# EAGLE design Adafruit Metro RP2040 (EAGLE 9.6.2)
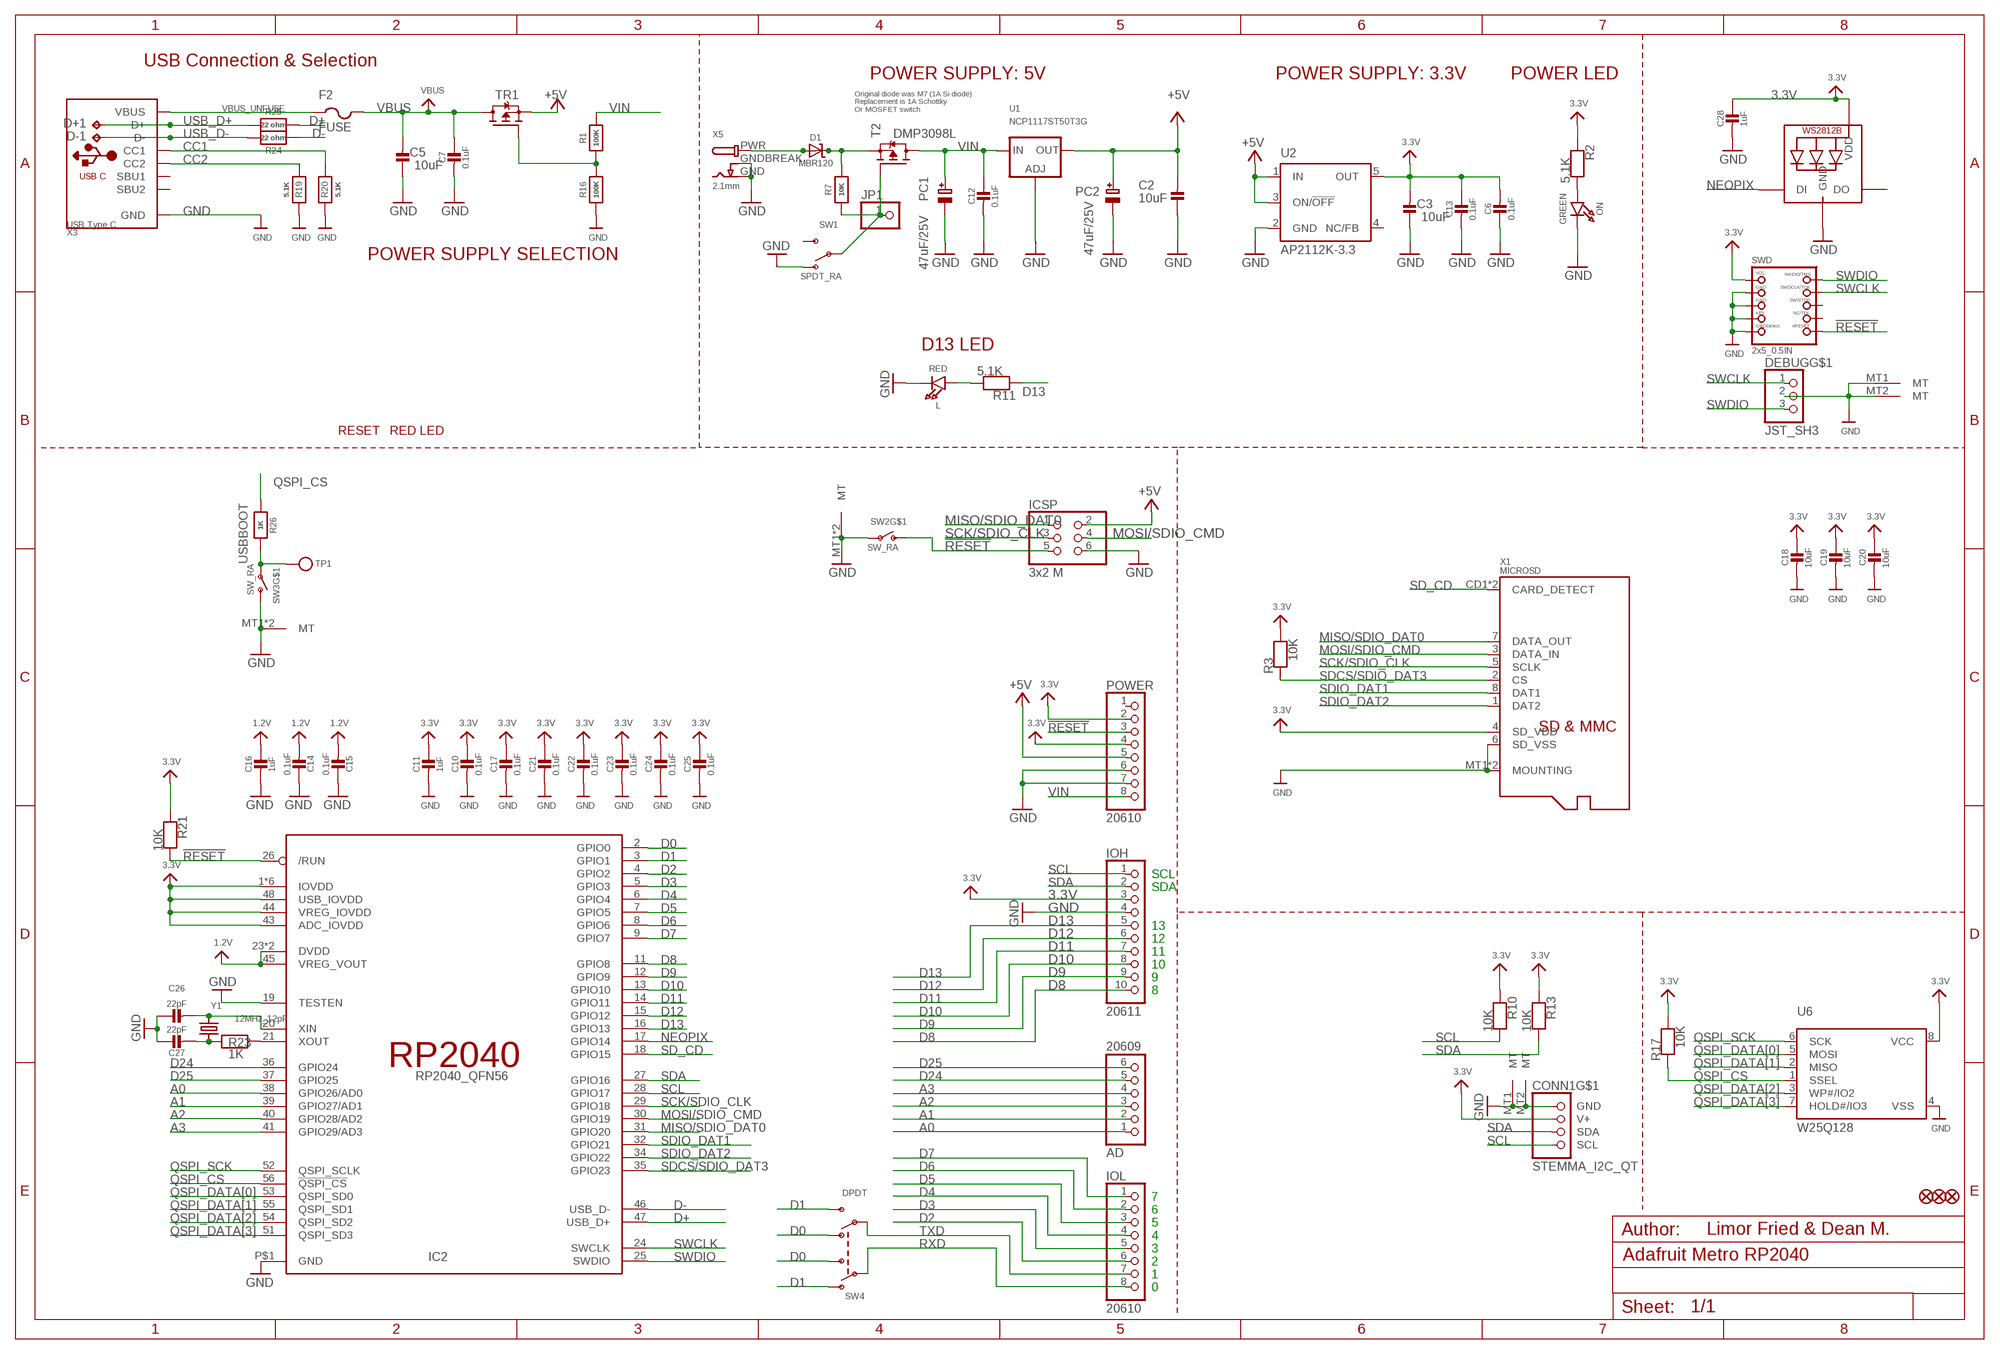
[diagram p0: schematic, sheet 1]

## Parts
AD  20609  HEADER-1X6OVALWAVE  [1X06_OVALWAVE]
C2  10uF  CAP_CERAMIC0805-NOOUTLINE  [0805-NO]
C3  10uF  CAP_CERAMIC0805-NOOUTLINE  [0805-NO]
C5  10uF  CAP_CERAMIC0805-NOOUTLINE  [0805-NO]
C6  0.1uF  CAP_CERAMIC0603_NO  [0603-NO]
C7  0.1uF  CAP_CERAMIC0603_NO  [0603-NO]
C10  0.1uF  CAP_CERAMIC0603_NO  [0603-NO]
C11  1uF  CAP_CERAMIC0603_NO  [0603-NO]
C12  0.1uF  CAP_CERAMIC0603_NO  [0603-NO]
C13  0.1uF  CAP_CERAMIC0603_NO  [0603-NO]
C14  0.1uF  CAP_CERAMIC0603_NO  [0603-NO]
C15  0.1uF  CAP_CERAMIC0603_NO  [0603-NO]
C16  1uF  CAP_CERAMIC0603_NO  [0603-NO]
C17  0.1uF  CAP_CERAMIC0603_NO  [0603-NO]
C18  10uF  CAP_CERAMIC0805-NOOUTLINE  [0805-NO]
C19  10uF  CAP_CERAMIC0805-NOOUTLINE  [0805-NO]
C20  10uF  CAP_CERAMIC0805-NOOUTLINE  [0805-NO]
C21  0.1uF  CAP_CERAMIC0603_NO  [0603-NO]
C22  0.1uF  CAP_CERAMIC0603_NO  [0603-NO]
C23  0.1uF  CAP_CERAMIC0603_NO  [0603-NO]
C24  0.1uF  CAP_CERAMIC0603_NO  [0603-NO]
C25  0.1uF  CAP_CERAMIC0603_NO  [0603-NO]
C26  22pF  CAP_CERAMIC0603_NO  [0603-NO]
C27  22pF  CAP_CERAMIC0603_NO  [0603-NO]
C28  1uF  CAP_CERAMIC0603_NO  [0603-NO]
CONN1  STEMMA_I2C_QT  [JST_SH4]
D1  MBR120  DIODE-SCHOTTKYSOD-123  [SOD-123]
D+1  TPB1,27  [B1,27]
D-1  TPB1,27  [B1,27]
DEBUG  JST_SH3  CON_JST_SH_3PINSH  [JST_SH3]
F2  FUSE  PTCFUSE-1206  [R1206]
FD1  FIDUCIAL_1MM  [FIDUCIAL_1MM]
FD2  FIDUCIAL_1MM  [FIDUCIAL_1MM]
FD3  FIDUCIAL_1MM  [FIDUCIAL_1MM]
IC2  RP2040_QFN56  [QFN56_7MM_REDUCEDEPAD]
ICSP  3x2 M  HEADER-2X3  [2X03_ROUND_70MIL]
IOH  20611  HEADER-1X10OVALWAVE  [1X10_OVALWAVE]
IOL  20610  HEADER-1X8OVALWAVE  [1X08_OVALWAVE]
JP1  HEADER-1X1ROUND  [1X01_ROUND]
L  RED  LED0603_NOOUTLINE  [CHIPLED_0603_NOOUTLINE]
LED2  WS2812B_3535FULL  [LED3535_FULLPADS]
ON  GREEN  LED0603_NOOUTLINE  [CHIPLED_0603_NOOUTLINE]
PC1  47uF/25V  CAP_ELECTROLYTICPANASONIC_D  [PANASONIC_D]
PC2  47uF/25V  CAP_ELECTROLYTICPANASONIC_D  [PANASONIC_D]
POWER  20610  HEADER-1X8OVALWAVE  [1X08_OVALWAVE]
R1  100K  RESISTOR_0603_NOOUT  [0603-NO]
R2  5.1K  RESISTOR_0603_NOOUT  [0603-NO]
R3  10K  RESISTOR_0603_NOOUT  [0603-NO]
R7  10K  RESISTOR_0603_NOOUT  [0603-NO]
R10  10K  RESISTOR_0603_NOOUT  [0603-NO]
R11  5.1K  RESISTOR_0603_NOOUT  [0603-NO]
R13  10K  RESISTOR_0603_NOOUT  [0603-NO]
R16  100K  RESISTOR_0603_NOOUT  [0603-NO]
R17  10K  RESISTOR_0603_NOOUT  [0603-NO]
R19  5.1K  RESISTOR_0603_NOOUT  [0603-NO]
R20  5.1K  RESISTOR_0603_NOOUT  [0603-NO]
R21  10K  RESISTOR_0603_NOOUT  [0603-NO]
R23  1K  RESISTOR_0603_NOOUT  [0603-NO]
R24  22 ohm  RESISTOR_0603_NOOUT  [0603-NO]
R25  22 ohm  RESISTOR_0603_NOOUT  [0603-NO]
R26  1K  RESISTOR_0603_NOOUT  [0603-NO]
SW1  SPDT_RA  SWITCH_SPDT  [SPDT_SMT_SSSS811101]
SW2  SW_RA  SWITCH_SPST_MNT_TACT_RA  [SPST_TACTILE_RA]
SW3  SW_RA  SWITCH_SPST_MNT_TACT_RA  [SPST_TACTILE_RA]
SW4  DPDT  SWITCH_DPDTEG1390  [EG1390]
SWD  2x5_0.5IN  JTAG-CORTEXBOXPOSTS  [2X05_1.27MM_BOX_POSTS]
T2  DMP3098L  MOSFET-PWIDE  [SOT23-WIDE]
TP1  TESTPOINTROUND1.5MMNO  [TESTPOINT_ROUND_1.5MM_NO]
TR1  DMP3098L  MOSFET-PWIDE  [SOT23-WIDE]
U1  NCP1117ST50T3G  LM1117SOT223-REFLOW  [SOT223-R]
U2  AP2112K-3.3  LP2985-XXDBVR33  [SOT23-DBV]
U6  W25Q128  SPIFLASH_8PIN208MIL  [SOIC8_208MIL]
X1  MICROSD  [MICROSD]
X3  USB Type C  USB_C  [USB_C_CUSB31-CFM2AX-01-X]
X5  2.1mm  DCBARRELPTH  [DCJACK_2MM_PTH]
Y1  12MHz_12pF  CRYSTAL2.5X2.0  [CRYSTAL_2.5X2]

## Nets
1.2V: C14.2 C15.2 C16.1 IC2.23(DVDD) IC2.45(VREG_VOUT) IC2.50(DVDD)
3.3V: C3.2 C6.2 C10.1 C11.1 C13.1 C17.1 C18.1 C19.1 C20.1 C21.1 C22.1 C23.1 C24.1 C25.1 C28.1 CONN1.2(V+) IC2.1(IOVDD) IC2.10(IOVDD) IC2.22(IOVDD) IC2.33(IOVDD) IC2.42(IOVDD) IC2.43(ADC_IOVDD) IC2.44(VREG_IOVDD) IC2.48(USB_IOVDD) IC2.49(IOVDD) IOH.3 LED2.2(VDD) POWER.2 POWER.4 R2.1 R3.2 R10.1 R13.1 R17.2 R21.1 SWD.1(VCC) U2.5(OUT) U6.8(VCC) X1.4(SD_VDD)
!RESET: IC2.26(/RUN) ICSP.5 POWER.3 R21.2 SW2.2(S) SWD.10(NRESET)
+5V [HIGHPOWER]: C2.2 ICSP.2 PC2.+ POWER.5 TR1.2(S) U1.2(OUT) U1.4(OUT) U2.1(IN) U2.3(ON/!OFF)
A0: AD.1 IC2.38(GPIO26/AD0)
A1: AD.2 IC2.39(GPIO27/AD1)
A2: AD.3 IC2.40(GPIO28/AD2)
A3: AD.4 IC2.41(GPIO29/AD3)
CC1: R20.2 X3.A5(CC1)
CC2: R19.2 X3.B5(CC2)
D0: IC2.2(GPIO0) SW4.O2 SW4.S1
D1: IC2.3(GPIO1) SW4.O1 SW4.S2
D2: IC2.4(GPIO2) IOL.6
D3: IC2.5(GPIO3) IOL.5
D4: IC2.6(GPIO4) IOL.4
D5: IC2.7(GPIO5) IOL.3
D6: IC2.8(GPIO6) IOL.2
D7: IC2.9(GPIO7) IOL.1
D8: IC2.11(GPIO8) IOH.10
D9: IC2.12(GPIO9) IOH.9
D10: IC2.13(GPIO10) IOH.8
D11: IC2.14(GPIO11) IOH.7
D12: IC2.15(GPIO12) IOH.6
D13: IC2.16(GPIO13) IOH.5 R11.1
D24: AD.5 IC2.36(GPIO24)
D25: AD.6 IC2.37(GPIO25)
D+: IC2.47(USB_D+) R25.2
D-: IC2.46(USB_D-) R24.2
GND: C2.1 C3.1 C5.1 C6.1 C7.2 C10.2 C11.2 C12.2 C13.2 C14.1 C15.1 C16.2 C17.2 C18.2 C19.2 C20.2 C21.2 C22.2 C23.2 C24.2 C25.2 C26.1 C27.1 C28.2 CONN1.1(GND) CONN1.MT1(MT) CONN1.MT2(MT) DEBUG.2 DEBUG.MT1(MT) DEBUG.MT2(MT) IC2.19(TESTEN) IC2.P$1(GND) ICSP.6 IOH.4 L.C LED2.4(GND) ON.C PC1.- PC2.- POWER.6 POWER.7 R16.1 R19.1 R20.1 SW1.A(O) SW2.1(P) SW2.MT1(MT) SW2.MT2(MT) SW3.2(S) SW3.MT1(MT) SW3.MT2(MT) SWD.3(GND) SWD.5(GND) SWD.7(KEY) SWD.9(GNDDETECT) U1.1(ADJ) U2.2(GND) U6.4(VSS) X1.6(SD_VSS) X1.MT1(MOUNTING) X1.MT2(MOUNTING) X3.A1B12(GND) X3.B1A12(GND) X5.GND X5.GNDBREAK
MISO/SDIO_DAT0: IC2.31(GPIO20) ICSP.1 X1.7(DATA_OUT)
MOSI/SDIO_CMD: IC2.30(GPIO19) ICSP.4 X1.3(DATA_IN)
N$1: L.A R11.2
N$2: ON.A R2.2
N$9: C26.2 IC2.20(XIN) Y1.3
N$10: C27.2 R23.1 Y1.1
N$11: R1.1 R16.2 TR1.1(G)
N$12: IC2.21(XOUT) R23.2
N$15: D1.C R7.2 T2.2(S)
NEOPIX: IC2.17(GPIO14) LED2.1(DI)
PWR_SWITCH: JP1.1 R7.1 SW1.B(P) T2.1(G)
PWRIN [HIGHPOWER]: D1.A X5.PWR
QSPI_CS: IC2.56(!QSPI_CS) R17.1 R26.1 U6.1(SSEL)
QSPI_DATA[0]: IC2.53(QSPI_SD0) U6.5(MOSI)
QSPI_DATA[1]: IC2.55(QSPI_SD1) U6.2(MISO)
QSPI_DATA[2]: IC2.54(QSPI_SD2) U6.3(WP#/IO2)
QSPI_DATA[3]: IC2.51(QSPI_SD3) U6.7(HOLD#/IO3)
QSPI_SCK: IC2.52(QSPI_SCLK) U6.6(SCK)
RXD: IOL.8 SW4.P1
SCK/SDIO_CLK: IC2.29(GPIO18) ICSP.3 X1.5(SCLK)
SCL: CONN1.4(SCL) IC2.28(GPIO17) IOH.1 R10.2
SD_CD: IC2.18(GPIO15) X1.CD1(CARD_DETECT) X1.CD2(CARD_DETECT)
SDA: CONN1.3(SDA) IC2.27(GPIO16) IOH.2 R13.2
SDCS/SDIO_DAT3: IC2.35(GPIO23) R3.1 X1.2(CS)
SDIO_DAT1: IC2.32(GPIO21) X1.8(DAT1)
SDIO_DAT2: IC2.34(GPIO22) X1.1(DAT2)
SWCLK: DEBUG.1 IC2.24(SWCLK) SWD.4(SWDCLK)
SWDIO: DEBUG.3 IC2.25(SWDIO) SWD.2(SWDIO)
TXD: IOL.7 SW4.P2
USB_D+: D+1.TP R25.1 X3.A6(D+) X3.B6(D+)
USB_D-: D-1.TP R24.1 X3.A7(D-) X3.B7(D-)
USBBOOT: R26.2 SW3.1(P) TP1.P$1
VBUS [HIGHPOWER]: C5.2 C7.1 F2.2 TR1.3(D)
VBUS_UNFUSE [HIGHPOWER]: F2.1 X3.A4B9(VBUS) X3.B4A9(VBUS)
VIN [HIGHPOWER]: C12.1 PC1.+ POWER.8 R1.2 T2.3(D) U1.3(IN)
Unconnected: LED2.3(DO) POWER.1 SW1.C(S) SWD.6(SWO) SWD.8(TDI) U2.4(NC/FB) X3.A8(SBU1) X3.B8(SBU2)

## Notes on the sheet
- USB Connection & Selection
- POWER SUPPLY: 5V | POWER SUPPLY: 3.3V | POWER LED
- Original diode was M7 (1A Si diode)
  Replacement is 1A Schottky
  Or MOSFET switch
- POWER SUPPLY SELECTION
- D13 LED
- RESET | RED LED
- SCL
- SDA
- 13
- 12
- 11
- 10
- 9
- 8
- 7
- 6
- 5
- 4 | Limor Fried & Dean M.
- 3
- 2
- 1
- 0

## Library data of the parts
AD = microbuilder:HEADER-1X6: PIN HEADER
C2 C3 C5-C7 C10-C28 = microbuilder:CAP_CERAMIC: Ceramic Capacitors For new designs, use the packages preceded by an '_' character since they are more reliable: The following footprints should be used on most boards: _0402 - Standard footprint for regular board layouts _0603 - Standard footprint for regular board layouts _0805 - Standard footprint for regular board layouts _1206 - Standard footprint for regular board layouts For extremely tight-pitch boards where space is at a premium, the following 'micro-pitch' footprints can be used (smaller pads, no silkscreen outline, etc.): _0402MP - Micro-pitch footprint for very dense/compact boards _0603MP - Micro-pitch footprint for very dense/compact boards _0805MP - Micro-pitch footprint for very dense/compact boards _1206MP - Micro-pitch footprint for very dense/compact boards
CONN1 = adafruit_electromech:STEMMA_I2C; LCSC: C2845363
D1 = microbuilder:DIODE-SCHOTTKY
D+1 D-1 = testpad:TP: Test pad
DEBUG = adafruit_electromech:CON_JST_SH_3PIN
F2 = adafruit:PTCFUSE: PTC fuses, resettable thermistors
FD1-FD3 = microbuilder:FIDUCIAL: Fiducial Alignment Points Various fiducial points for machine vision alignment.; BOM: EXCLUDE
IC2 = adafruit_micro:RP2040; LCSC: C2040
ICSP = microbuilder:HEADER-2X3: PIN HEADER
IOH = microbuilder:HEADER-1X10: PIN HEADER
IOL POWER = microbuilder:HEADER-1X8: PIN HEADER
JP1 = microbuilder:HEADER-1X1: PIN HEADER
L ON = microbuilder:LED: LED 0603 - 0603 Surface Mount Package 2mA: Green LED - Low Power (3.9mcd, 2ma, 1.7Vf) - Digikey: 475-2709-2-ND Orange LED - Low Power (9.8mcd, 2ma, 1.8Vf) - Digikey: 475-1194-2-ND Red LED - Low Power (5mcd, 2ma, 1.8Vf) - Digikey: 475-1195-2-ND Yellow LED - Low Power (7mcd, 2ma, 1.8Vf) - Digikey: 475-1196-2-ND 5mA: Blue LED - Low Power (17mcd, 5ma, 2.9Vf) - Digikey: LNJ937W8CRACT-ND 0805 - 0805 Surface Mount Package 2mA: Red LED (8.8mcd, 2mA, 1.8Vf, Clear) - Low Power [Digikey: 475-2510-1-ND] Green LED (5mcd, 2mA, 1.8Vf, Clear) - Low Power [Digikey: 475-2730-1-ND] Yellow LED (11.3mcd, 2mA, 1.8Vf, Clear) - Low Power [Digikey: 475-2555-1-ND] 20mA: Red LED (104mcd, 20mA, Diffused) - LS R976 [Digikey: 475-1278-6-ND] Red LED (12mcd, 20mA, 2.0Vf, Clear) - APT2012EC [Digikey: 754-1128-1-ND] Green LED (15mcd, 20mA, 2.2Vf, Clear) - APT2012GC [Digikey: 754-1131-1-ND] Orange LED (160mcd, 20mA, 2.1Vf, Clear) - APT2012SECK [Digikey: 754-1130-1-ND] 1206 - 1206 Surface Mount Package Green LED (26mcd, 20mA, Diffused) - LG N971 [Digikey: 475-1407-6-ND] Red LED (15mcd, 20mA, Diffused) - LH N974 [Digikey: 475-1416-6-ND] Cree - Cree High-Power Surface Mount LEDs XPEBWT-L1-0000-00D50 - White 111lm 350mA 2.9Vf 6200K 110° XTEAWT-00-0000-00000LEE3 - White 114lm 350mA 2.85Vf 5000K 115° Everlight - Everlight 45-21 Series Surface Mount LEDs 45-21/QK2C-B2832AC2CB2/2T - Warm White 2000mcd 20mA 3.25Vf 3050K 120° 45-21/LK2C-B38452C4CB2/2T - Nuetral White 2000mcd 20mA 3.25Vf 4150K 120° 45-21/LK2C-B50634C6CB2/2T - Cold White 2200mcd 20mA 3.25Vf 5650K 120° PLCC2 Reverse Mount LS T77K-J1L2-1-0-2-R18-Z - Red 11.25mcd 2mA 1.8Vf 630nm 120° LO T77K-L1M2-24-Z - Orange 19.6mcd 2mA 1.8Vf 606nm 120° LY T77K-K2M1-26-Z - Yellow 15.7mcd 2mA 1.8Vf 587nm 120°; ROT: 270
LED2 = microbuilder:WS2812B
PC1 PC2 = microbuilder:CAP_ELECTROLYTIC: Electrolytic Capacitors SMT PANASONIC_C - Size C Panasonic Electrolytic Aluminum Capacitor 47µF 16V 20% Electrolytic Capacitor [Digikey: PCE3890TR-ND] PANASONIC_D - Size D Panasonic Electrolytic Aluminum Capacitor 100µF 25V 20% Electrolytic Capacitor [Digikey: PCE3898TR-ND] PTH 3.5 mm grid, 8 mm diameter ... 3.5 mm grid, 10 mm diameter ...
R1-R3 R7 R10 R11 R13 R16 R17 R19-R21 R23-R26 = microbuilder:RESISTOR: Resistors For new designs, use the packages preceded by an '_' character since they are more reliable: The following footprints should be used on most boards: _0402 - Standard footprint for regular board layouts _0603 - Standard footprint for regular board layouts _0805 - Standard footprint for regular board layouts _1206 - Standard footprint for regular board layouts For extremely tight-pitch boards where space is at a premium, the following 'micro-pitch' footprints can be used (smaller pads, no silkscreen outline, etc.): _0402MP - Micro-pitch footprint for very dense/compact boards _0603MP - Micro-pitch footprint for very dense/compact boards _0805MP - Micro-pitch footprint for very dense/compact boards _1206MP - Micro-pitch footprint for very dense/compact boards
SW1 = adafruit_electromech:SWITCH_SPDT: Switch - SPDT SSSS811101 - Horizontal Two Position SMT, 0.3A 4V [Mouser: 688-SSSS811101]
SW2 SW3 = adafruit_electromech:SWITCH_SPST_MNT: Switch - SPST 4UCon 19192 (6.7x2.6mm SMT); LCSC: C778159
SW4 = adafruit_electromech:SWITCH_DPDT: Switch - DPDT A DPDT Switch acts like an SPDT switch, but has a pair of switches instead of just one. Vertical - 0.3A @ 6V SMT - Digikey: JS202011SCQN; LCSC: C2837066
SWD = adafruit_electromech:JTAG-CORTEX: Serial Wire (SW-DP) Connector Standard 0.05" 10-pin connector is for use with the Cortex M and Cortex A SWD (serial wire debugger) interface (SW-DP) Connectors 2x05_1.27MM_SMT - Inexpensive surface-mount header with bare pins, compatible with standard 10-pin SWD cables (4UCON: 16846) 2x05_1.27MM_BOX_NOPOSTS - Polarised surface-mount box (4UCON with caps: 19735, without caps: 15117 2x05_1.27MM_BOX_POSTS - Polarised surface-mount box with mounting holes (4UCON: 20317) Pinout: http://infocenter.arm.com/help/topic/com.arm.doc.faqs/attached/13634/cortex_debug_connectors.pdf http://www.keil.com/peripherals/coresight/connectors.asp
T2 TR1 = microbuilder:MOSFET-P: P-Channel Mosfet LEGEND VDS: Voltage Drain-Source ID: Drain Current RDS(ON): Drain-Source On-State Resistance VGS(TH): Gate-Source Threshold Voltage CISS: Drain-Source Input Capacitance SOT-23 Name VDS ID RDS(ON) VGS(TH) CISS Order Number IRLML5103 30V 760mA 600 mOhm -- 75pF @ 25V Digikey: IRLML5103PBFCT-ND IRLML6401 12V 4.3A 50 mOhm 950mV @ 250µA 830pF @ 10V Digikey: IRLML6401PBFTR-ND NTR0202PL 20V 400mA 800 mOhm 2.3V @ 250uA 70pF @ 5V Digikey: NTR0202PLT1GOSTR-ND NTR4101PT1G 20V 1.8A 85 mOhm 1.2V @ 250uA 675pF @ 10V Digikey: NTR4101PT1GOSCT-ND DMP2004K 20V 600mA 900 mOhm 1V @ 250uA 175pF @ 16V Digikey: DMP2004KDICT-ND PMV65XP 20V 3.9A 76 mOhm 950mV @ 1mA 725pF @ 20V Digikey: 568-2358-2-ND TO-252 Name VDS ID RDS(ON) VGS(TH) CISS Order Number AOD417 30V 25A 34 mOhm 3V @ 250µA 920pF @ 15V Digikey: 785-1106-2-ND PowerPak Name VDS ID RDS(ON) VGS(TH) CISS Order Number AON7401 30V 12A 14 mOhm 3V @ 250µA 2600pF @ 15V Digikey: 785-1302-1-ND
TP1 = microbuilder:TESTPOINT: Test Point Various test points for characterisation and PCB testing TESTPOINT_SMT - Compact Surface Mount Test Point [Digikey: 5016KTR-ND]
U1 = microbuilder:LM1117: LM1117 Voltage Regulator LM1117 Adjustable Voltage regulator [Digikey: LM1117IMP-ADJDKR-ND] LM1117 3.3V Voltage regulator [AP1117E33GDIDKR-ND] LM1117 5.0V Voltage regulator [AP1117E50GDIDKR-ND] SOT223-REFLOW - SOT223 package for solder paste/reflow ovens SOT223-WAVE - SOT223 package for hand-soldering (larger pads) Note: For the fixed-voltage regulators, simply set the ADJ pin to GND.
U2 = SmartPrj:LP2985-XXDBVR: ULTRALOW-POWER 50-mA LOW-DROPOUT LINEAR REGULATORS 50-mA Low-Dropout Regulator Source: http://focus.ti.com/lit/ds/symlink/tps77001.pdf
U6 = microbuilder:SPIFLASH_8PIN: SOIC8 SPI Flash Be careful with the size since SOIC8 flash comes in several 'widths' SOIC8 150 mil M25P16 - 16Mbit (2Mbit x 8) Serial Flash (75MHz SPI Bus), Supply: 2.7-3.6V Digikey: SOIC8 - M25P16-VMN6P-ND SOIC8 208 mil W25Q16BVSSIG - 16Mbit (2Mbit x 8) Serial Flash (104MHz SPI Bus), Supply: 2.7-3.6V Digikey: SOIC8 - W25Q16BVSSIG-ND
X1 = adafruit_electromech:MICROSD: MicroSD/Transflash Card Holder with SPI pinout 3M: 2908-05WB-MG 4UConnector: 19656 Footprint courtesy: Adafruit Industries; JLC_ROTATION: 90; LCSC: C125617
X3 = adafruit_electromech:USB_C: USB Type-C USB 2.0 Connector; LCSC: C165948
X5 = adafruit_electromech:DCBARREL: DC Barrel Jack DCJACK_1.3MM_PTH - Through Hole 1.3mm Jack (4UConnector: 05536) DCJACK_2MM_PTH - Through Hole 2.0/2.1 Jack (4UConnector: 05537) DCJACK_2MM_SMT - SMT 2.0/2.1mm Jack(4UConnector: 03267)
Y1 = microbuilder:CRYSTAL: Crystals HC49UP - Surface Mount Crystal 4.0MHz 18pF +/-30ppm Surface Mount Crystal [Digikey: 535-9857-1-ND] 12.0 MHz Surface Mount Crystal [Digikey: 535-9869-6-ND] 25.0 MHz Surface Mount Crystal [Digikey: 535-9078-1-ND] 2.5 x 2.0mm - MEMs SMT Crystal 16.0 MHz 10pF 20ppm 2.5 x 2.0mm Crystal [Digikey -40-85°C: 535-10923-1-ND] 3.2 x 2.5mm - MEMs SMT Crystal 12.0 MHz 8pF 15ppm 3.2 x 2.5mm Crystal [Digikey: -10-70°C: 644-1047-1-ND -40-125°C: 644-1128-1-ND] 40~85°C cheaper: 644-1173-6-ND 16.0 MHz 8pF 15ppm 3.2 x 2.5mm Crystal [Digikey: -10-70°C: 644-1049-1-ND -40-125°C: 644-1129-2-ND]-40~85°C cheaper: 644-1175-6-ND 16.0 MHz 10pF 10ppm 3.2 x 2.5mm Crystal [Digikey: 644-1100-1-ND] 27.12 MHz 18pF 30ppm 3.2 x 2.5mm Crystal [Digikey: 887-1424-1-ND] 27.12MHz 10pF 10ppm 3.2 x 2.5mm Crystal [Digikey: 887-1329-1-ND] 4.9 x 1.8mm - MEMs SMT Crystal 32.768 KHz 12.5pF 20ppm 4.9 x 1.8mm Crystal [Digikey: SE2415CT-ND] 8.0 x 3.8mm - Surface Mount Crystal 32.768kHz 12.5pF 20ppm -40°C-85°C [Digikey: 535-9166-2-ND] Cylinder 32.768KHz Cylinder Crystal (2x6mm body) [Ex. Digikey: 300-8341-2-ND]

## Net classes
1 power: width 0.305 mm
3 HIGHPOWER: width 0.254 mm, drill 0.483 mm
4 LOWPOWER: width 0.254 mm

## Board
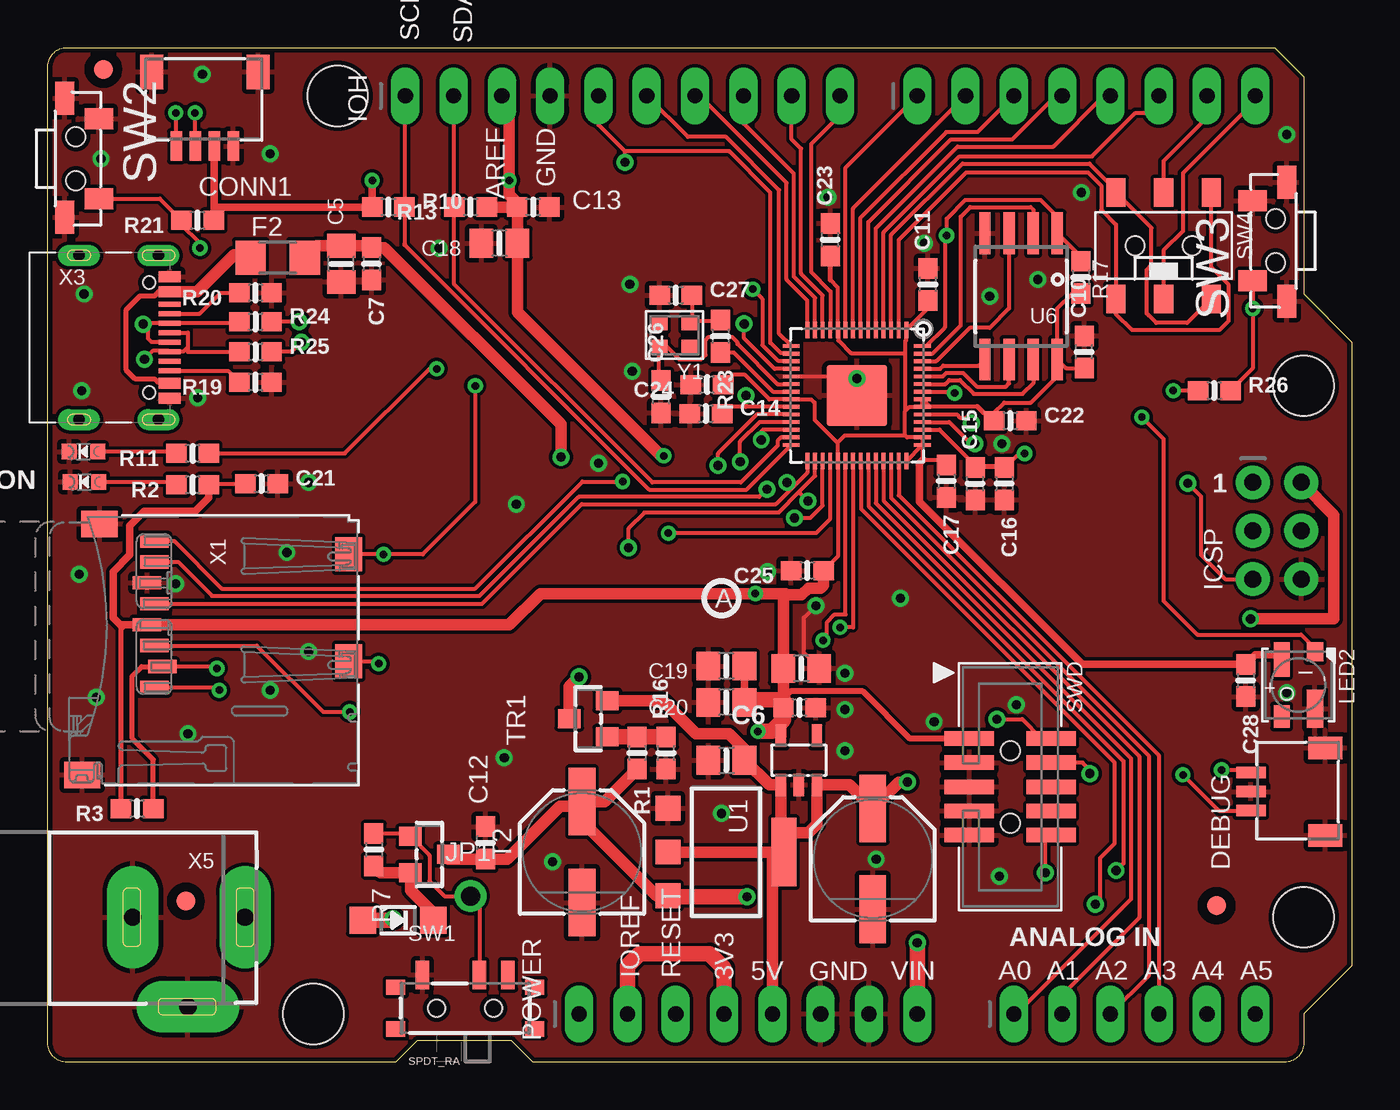
[diagram p1: board, top side]
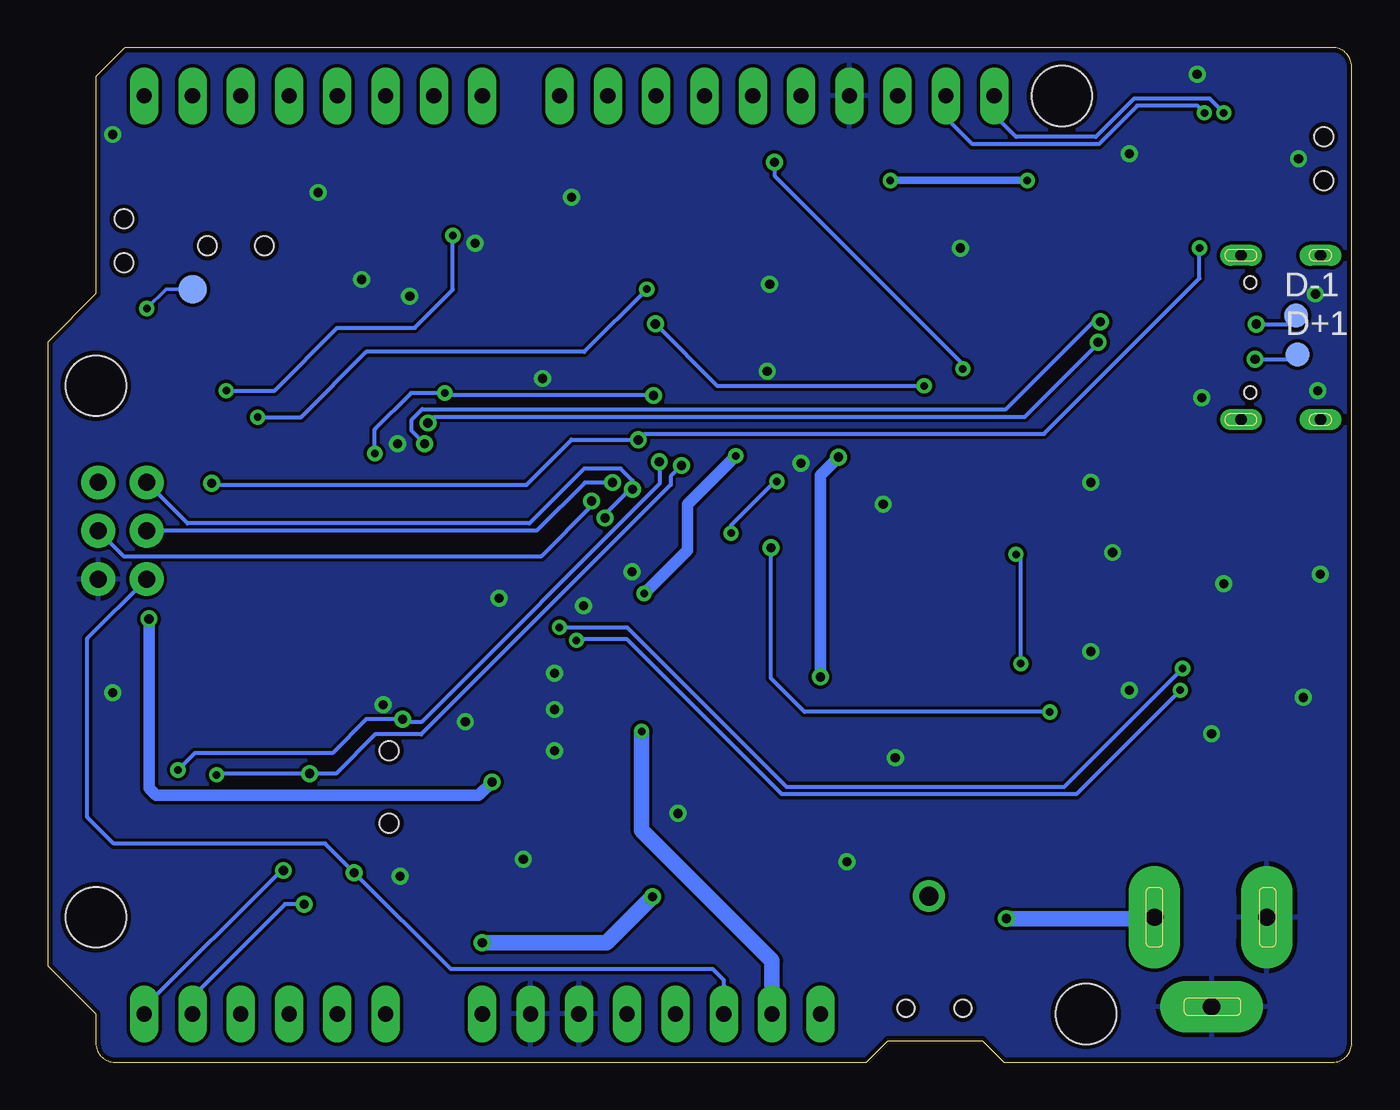
[diagram p2: board, bottom side, seen from below]

Size 68.58 x 53.34 mm. Coordinates in mm from the lower left corner, seen from the top.
Outline: 64.52,53.34 66.04,51.82 66.04,40.39 68.58,37.85 68.58,5.08 66.04,2.54 66.04,1 arc-90 65.04,0 25.53,0 24.38,1.14 19.43,1.14 18.29,0 1,0 arc-90 0,1 0,52.34 arc-90 1,53.34 64.52,53.34
Copper layers (1*16): Top 0.035mm / dielectric 1.5mm / Bottom 0.035mm
Design rules "adafruit 7-7": minimum track width 7mil, minimum drill 15.5mil, track to track 7mil, track to pad 7mil, pad to pad 7mil, via to via 7mil, smd to smd 7mil, copper to edge 10mil, drill to drill 8mil, minimum pad ring 10mil, minimum via ring 8mil, stop-mask expansion 2mil, vias tented up to drill 20mil, thermal gap 10mil
Holes 3.17 mm at 66.04,35.56 66.04,7.62 15.24,50.8 13.97,2.54

### Footprints (pad centres in the part's own frame; a part is rotated, then mirrored left to right if it is on the bottom)
1X06_OVALWAVE = drill 0.8 pad 1.5 long: 1 -6.35,0; 2 -3.81,0; 3 -1.27,0; 4 1.27,0; 5 3.81,0; 6 6.35,0
0805-NO = smd 1.24 x 1.5: 1 -0.95,0; 2 0.95,0
0603-NO = smd 1.075 x 1: 1 -0.85,0; 2 0.85,0
JST_SH4 = smd 0.6 x 1.55: 1 -1.5,2.006; 2 -0.5,2.006; 3 0.5,2.006; 4 1.5,2.006 | smd 1.2 x 1.8: MT1 -2.8,-1.894; MT2 2.8,-1.894
SOD-123 = smd 1.4 x 1.4: A 1.85,0; C -1.85,0
B1,27 = smd 1.27 x 1.27: TP 0,0
JST_SH3 = smd 0.6 x 1.55: 1 -1,2.006; 2 0,2.006; 3 1,2.006 | smd 1.2 x 1.8: MT1 -2.3,-1.894; MT2 2.3,-1.894
R1206 = smd 1.6 x 1.803: 1 -1.422,0; 2 1.422,0
FIDUCIAL_1MM = smd 1 x 1: 1 0,0
QFN56_7MM_REDUCEDEPAD = smd 0.875 x 0.2: 1 -3.45,2.6; 2 -3.45,2.2; 3 -3.45,1.8; 4 -3.45,1.4; 5 -3.45,1; 6 -3.45,0.6; 7 -3.45,0.2; 8 -3.45,-0.2; 9 -3.45,-0.6; 10 -3.45,-1; 11 -3.45,-1.4; 12 -3.45,-1.8; 13 -3.45,-2.2; 14 -3.45,-2.6; 29 3.45,-2.6; 30 3.45,-2.2; 31 3.45,-1.8; 32 3.45,-1.4; 33 3.45,-1; 34 3.45,-0.6; 35 3.45,-0.2; 36 3.45,0.2; 37 3.45,0.6; 38 3.45,1; 39 3.45,1.4; 40 3.45,1.8; 41 3.45,2.2; 42 3.45,2.6 | smd 0.2 x 0.875: 15 -2.6,-3.45; 16 -2.2,-3.45; 17 -1.8,-3.45; 18 -1.4,-3.45; 19 -1,-3.45; 20 -0.6,-3.45; 21 -0.2,-3.45; 22 0.2,-3.45; 23 0.6,-3.45; 24 1,-3.45; 25 1.4,-3.45; 26 1.8,-3.45; 27 2.2,-3.45; 28 2.6,-3.45; 43 2.6,3.45; 44 2.2,3.45; 45 1.8,3.45; 46 1.4,3.45; 47 1,3.45; 48 0.6,3.45; 49 0.2,3.45; 50 -0.2,3.45; 51 -0.6,3.45; 52 -1,3.45; 53 -1.4,3.45; 54 -1.8,3.45; 55 -2.2,3.45; 56 -2.6,3.45 | smd 3.2 x 3.2: P$1 0,0
2X03_ROUND_70MIL = drill 0.9 pad 1.778: 1 -2.54,-1.27; 2 -2.54,1.27; 3 0,-1.27; 4 0,1.27; 5 2.54,-1.27; 6 2.54,1.27
1X10_OVALWAVE = drill 0.8 pad 1.5 long: 1 -11.43,0; 2 -8.89,0; 3 -6.35,0; 4 -3.81,0; 5 -1.27,0; 6 1.27,0; 7 3.81,0; 8 6.35,0; 9 8.89,0; 10 11.43,0
1X08_OVALWAVE = drill 0.8 pad 1.5 long: 1 -8.89,0; 2 -6.35,0; 3 -3.81,0; 4 -1.27,0; 5 1.27,0; 6 3.81,0; 7 6.35,0; 8 8.89,0
1X01_ROUND = drill 1 pad 1.676: 1 0,0
CHIPLED_0603_NOOUTLINE = smd 0.8 x 0.8: A 0,-0.75; C 0,0.75
LED3535_FULLPADS = smd 1 x 0.85: 1 -1.75,0.875 | smd 1.8 x 0.85: 2 -1.35,-0.875 | smd 1.2 x 0.85: 3 1.65,-0.875 | smd 2 x 0.85: 4 1.25,0.875
PANASONIC_D = smd 3.556 x 1.4: + 2.654,0; - -2.654,0
SPDT_SMT_SSSS811101 = smd 0.7 x 1.5: A -2.25,1.242; B 0.75,1.242; C 2.25,1.242 | smd 1 x 0.8: SUP1 -3.65,0.592; SUP2 -3.65,-1.608; SUP3 3.65,0.592; SUP4 3.65,-1.608 | hole 0.9: -1.5,-0.508; 1.5,-0.508
SPST_TACTILE_RA = smd 1.1 x 1.5: 1 2.1,-0.9; 2 -2.1,-0.9 | smd 1.75 x 1: MT1 3.175,0.9; MT2 -3.075,0.9 | hole 1: 1.15,0.3; -1.15,0.3
EG1390 = smd 1 x 1.5: O1 -2.5,2.8; O2 -2.5,-2.8; P1 0,2.8; P2 0,-2.8; S1 2.5,2.8; S2 2.5,-2.8 | hole 1: 1.5,0; -1.5,0
2X05_1.27MM_BOX_POSTS = smd 0.76 x 2.6: 1 -2.54,-2.15; 2 -2.54,2.15; 3 -1.27,-2.15; 4 -1.27,2.15; 5 0,-2.15; 6 0,2.15; 7 1.27,-2.15; 8 1.27,2.15; 9 2.54,-2.15; 10 2.54,2.15 | hole 1: -1.905,0; 1.905,0
SOT23-WIDE = smd 1 x 1.2: 1 -0.95,-1; 2 0.95,-1; 3 0,1
TESTPOINT_ROUND_1.5MM_NO = smd 1.5 x 1.5: P$1 0,0
SOT223-R = smd 1.3 x 1.3: 1 -2.3,-3.05; 2 0,-3.05; 3 2.3,-3.05 | smd 3.6 x 1.3: 4 0,3.05
SOT23-DBV = smd 0.55 x 1.2: 1 -0.95,-1.3; 2 0,-1.3; 3 0.95,-1.3; 4 0.95,1.3; 5 -0.95,1.3
SOIC8_208MIL = smd 0.6 x 2.2: 1 -1.905,-3.315; 2 -0.635,-3.315; 3 0.635,-3.315; 4 1.905,-3.315; 5 1.905,3.315; 6 0.635,3.315; 7 -0.635,3.315; 8 -1.905,3.315
MICROSD = smd 0.7 x 1.5: 1 1.761,-3.147; 2 0.661,-2.747; 3 -0.439,-3.147; 4 -1.539,-3.547; 5 -2.639,-3.147; 6 -3.739,-3.547; 7 -4.839,-3.147; 8 -5.939,-3.147 | smd 1.8 x 1.4: CD1 -5.239,7.053; CD2 0.38,7.053 | smd 1.4 x 1.9: MT1 -6.839,-6.047; MT2 6.361,-6.947
USB_C_CUSB31-CFM2AX-01-X = smd 0.575 x 1.15: A1B12 -3.2,2.275; A4B9 -2.4,2.275; B1A12 3.2,2.275; B4A9 2.4,2.275 | smd 0.275 x 1.15: A5 -1.25,2.275; A6 -0.25,2.275; A7 0.25,2.275; A8 1.25,2.275; B5 1.75,2.275; B6 0.75,2.275; B7 -0.75,2.275; B8 -1.75,2.275 | drill 0.6 pad 1 long: M1 -4.32,1.7; M2 4.32,1.7; M3 -4.32,-2.48; M4 4.32,-2.48 | hole 0.65: 2.89,1.2; -2.89,1.2
DCJACK_2MM_PTH = drill 0.9 pad 2.7 long: GND -2.9,2.54; GNDBREAK 0,-2.16; PWR 3,2.54
CRYSTAL_2.5X2 = smd 0.9 x 0.75: 1 -0.825,-0.625; 2 0.825,-0.625; 3 0.825,0.625; 4 -0.825,0.625

### Placement (x,y rotation side)
AD  57.15,2.54 0 top
C2  35.69,15.88 0 top
C3  39.62,20.7 180 top
C5  15.43,41.97 90 top
C6  39.53,18.64 180 top
C7  17.02,41.97 270 top
C10  54.5,37.34 90 top
C11  46.28,40.89 90 top
C12  23.01,11.53 90 top
C13  25.53,44.96 0 top
C14  34.61,34.1 0 top
C15  48.77,30.42 90 top
C16  50.29,30.42 270 top
C17  47.24,30.54 270 top
C18  23.75,43.05 180 top
C19  35.69,20.83 180 top
C20  35.69,18.92 180 top
C21  11.24,30.42 0 top
C22  50.61,33.72 0 top
C23  41.15,43.24 90 top
C24  34.67,35.62 180 top
C25  39.94,25.84 180 top
C26  32.26,34.99 90 top
C27  33.02,40.32 0 top
C28  62.99,20.07 270 top
CONN1  8.26,50.16 180 top
D1  18.41,7.47 180 top
D+1  2.86,37.21 0 bottom
D-1  2.92,39.24 0 bottom
DEBUG  65.28,14.22 90 top
F2  12.09,42.29 0 top
FD1  2.92,52.2 0 top
FD2  61.46,8.23 0 top
FD3  7.26,8.46 0 top
IC2  42.55,35.05 270 top
ICSP  64.64,27.94 270 top
IOH  30.23,50.8 0 top
IOL  54.61,50.8 0 top
JP1  22.23,8.74 0 top
L  1.88,32.11 90 top
LED2  65.76,19.82 270 top
ON  1.93,30.51 90 top
PC1  28.09,11.05 90 top
PC2  43.38,10.69 90 top
POWER  36.83,2.54 0 top
R1  30.99,16.26 270 top
R2  7.62,30.35 180 top
R3  4.7,13.34 180 top
R7  17.14,11.18 270 top
R10  17.91,44.96 0 top
R11  7.62,32 180 top
R13  22.23,44.96 180 top
R16  32.51,16.26 90 top
R17  54.32,41.26 270 top
R19  10.92,35.75 180 top
R20  10.92,40.45 180 top
R21  7.87,44.26 180 top
R23  35.37,38.16 270 top
R24  10.92,38.93 0 top
R25  10.92,37.34 0 top
R26  61.34,35.31 0 top
SW1  21.95,3.35 0 top
SW2  1.78,47.5 90 top
SW3  64.26,43.18 270 top
SW4  58.67,42.93 180 top
SWD  50.61,14.48 270 top
T2  20.07,10.92 270 top
TP1  60.96,40.64 0 bottom
TR1  28.42,18.06 90 top
U1  35.66,11.05 270 top
U2  39.5,15.88 0 top
U6  51.18,40.26 180 top
U$11  [PCBFEAT-REV-040]  35.43,24.38 0 top
U$15  [METRO_RP2040_BOT]  68.58,0 0 bottom
U$29  [METRO_RP2040_TOP]  0,0 0 top
X1  8.76,21.46 270 top
X3  4.13,38.1 270 top
X5  7.37,5.08 0 top
Y1  32.96,38.23 180 top

### Tracks (layer width: path | path; a pad name or v marks a point on that pad's centre or on a via)
1.2V  (via drill 0.39, 0.48)
  Top 0.203: IC2.45 46.89,33.25 48.51,31.63 48.51,31.52 C15.2 | C15.2 48.83,31.33 50.42,31.33 50.97,31.88 51.24,31.88 v51.37,32 | C16.1 C15.2 | IC2.50 47.62,35.25 v47.69,35.18 | IC2.23 36.7,34.45 | 36.7,34.45 35.81,34.45 C14.2 | 36.7,34.45 36.7,35.03 v36.72,35.05
  Bottom 0.203: v51.37,32 51.37,33.27 49.47,35.18 v47.69,35.18 47.56,35.05 v36.72,35.05
3.3V  (via drill 0.39)
  Top 0.203: 48.88,34.47 46.38,34.47 IC2.49 46.1,34.85 45.99,34.75 IC2.48 45.31,34.45 45.09,34.23 | C11.1 46.28,39.64 IC2.1 45.13,38.48 45.13,37.95 45.09,37.91 45.09,37.27 | IC2.43 IC2.44 45.19,32.85 45.09,32.96 | IC2.42 IC2.43 | 45.09,32.96 45.09,34.23 | 45.09,37.27 45.09,34.23 | C24.1 36.03,36.13 36.66,36.13 37.94,34.85 IC2.22 40.14,34.85 40.32,34.67 40.32,33.77 41.5,32.59 41.55,32.59 | 41.55,32.59 IC2.33 41.55,26.6 C25.1 | 45.09,32.96 41.91,32.96 41.55,32.59 | IC2.10 41.56,38.48 41.56,37.95 42.24,37.27 45.09,37.27 | R2.1 8.53,30.42 C21.1 | 41.15,41.12 41.55,40.73 IC2.10 | IC2.43 45.99,31.69 46.02,31.67 46.97,31.67 C17.1 | C22.1 49.76,34.14 50.29,34.67 51.69,34.67 53.09,36.07 U6.8 | U6.8 53.54,36.49 C10.1 | v32.38,31.88 32.26,31.88 | IC2.10 | U6.8 53.09,39.62 53.87,40.41 R17.2
  Top 0.254: 24.89,44.74 C13.1 24.68,45.17 | 41.15,41.12 C23.1 | C22.1 49.63,33.72 48.88,34.47 | R3.2 3.85,22.79 4.06,23
  Top 0.305: SWD.1 45.34,17.02 42.86,19.49 39.05,19.49 38.68,19.13 C6.2
  Top 0.406: CONN1.2 8.76,45.05 | 8.76,45.05 8.76,44.29 R21.1 | 8.76,45.05 8.85,44.96 R10.1 v17.06,46.35 | X1.4 4.06,23 3.79,23 3.43,23.37 3.43,25.78 4.32,26.67 4.32,28.19 5.08,28.96 7.75,28.96 8.47,29.68 R2.1 | 24.7,44.55 24.89,44.74 | C19.1 C20.1 | LED2.2 64.63,21.43 63.51,21.43 C28.1 54.4,20.92 45.85,29.46 45.85,31.5 46.02,31.67
  Top 0.61: IOH.3 24.26,50.42 v24.26,46.35 24.26,45.59 24.68,45.17 | U2.5 38.55,17.87 38.67,18 C6.2 | C6.2 | 38.86,24.57 38.67,24.38 C3.2 38.67,19.05 C6.2 | C25.1 40.79,25.08 40.64,24.93 40,24.93 39.64,24.57 38.86,24.57 | R13.1 C13.1 | 24.7,44.55 C18.1 24.7,39.43 32.26,31.88 | 38.86,24.57 38.8,24.64 v37.21,24.64 25.91,24.64 24.26,22.99 5.23,22.99 X1.4
  Top 0.813: POWER.2 30.48,5.08 31.11,5.71 34.8,5.71 35.56,4.95 POWER.4 | 38.67,18 38.07,17.4 v37.34,17.4 | C20.1 36.76,19.05 38.67,19.05
  Bottom 0.203: v32.38,31.88
  Bottom 0.406: v17.06,46.35 v24.26,46.35
  Bottom 0.61: v32.38,31.88 34.92,29.34 34.92,26.92 v37.21,24.64
  Bottom 0.813: POWER.2 30.48,5.33 37.34,12.19 v37.34,17.4
!RESET  (via drill 0.39, 0.48)
  Top 0.203: v52.45,9.97 52.45,11.63 SWD.10 | IC2.26 37.61,33.25 37.52,33.16 v37.52,32.72 | v59.94,30.44 60.64,29.74 60.64,26.67 61.91,25.4 ICSP.5 | SW2.2 5.89,45.4 R21.2 7.02,44.03 8,43.05 v8,42.8
  Bottom 0.203: POWER.3 33.02,4.32 33.59,4.89 47.37,4.89 v52.45,9.97 53.98,11.49 65.09,11.49 66.48,12.89 66.48,22.29 ICSP.5 | v59.94,30.44 59.85,30.35 43.4,30.35 41.03,32.72 37.52,32.72 v37.52,32.72 37.2,33.03 16.18,33.03 8,41.21 v8,42.8
+5V  (via drill 0.48)
  Top 0.61: C2.2 37.94,14.57 U2.1 38.55,12.06 | C2.2 | U1.4 38.55,11.21 | 38.55,11.21 38.55,12.06 | 38.55,12.06 40.01,12.06 40.45,12.51 U2.3 42.16,14.57 PC2.+ 44.77,14.73 v45.21,14.73 | U1.2 38.38,11.05 | 38.38,11.05 38.55,11.21 | POWER.5 38.1,10.77 38.38,11.05 | TR1.2 32.34,19.01 34.08,17.27 35.81,17.27 36.64,16.45 C2.2 | v63.25,23.3 67.63,23.3 67.63,28.77 ICSP.2
  Bottom 0.61: v45.21,14.73 45.91,14.03 62.87,14.03 63.25,14.41 v63.25,23.3
A0
  Top 0.203: IC2.38 43.55,29.39 56.96,15.97 56.96,8.57 50.93,2.54 AD.1
A1
  Top 0.203: IC2.39 43.95,29.53 57.39,16.08 57.39,7.61 53.34,3.56 AD.2
A2
  Top 0.203: IC2.40 44.34,29.66 57.9,16.11 57.9,4.56 AD.3
A3
  Top 0.203: IC2.41 44.74,29.8 58.42,16.13 AD.4
CC1
  Top 0.203: X3.A5 7.98,39.35 9.08,40.45 R20.2
CC2
  Top 0.203: X3.B5 9.47,36.35 R19.2
D0
  Top 0.203: SW4.O2 61.17,41.79 62.1,40.86 62.1,38.99 61.59,38.48 57.02,38.48 56.17,39.33 SW4.S1 56.17,44.03 55.4,44.81 55.4,46.08 54.7,46.77 48.29,46.77 44.74,43.23 IC2.2
D1
  Top 0.203: IC2.3 44.34,43.49 48.1,47.24 54.78,47.24 56.17,45.85 SW4.S2 58.04,43.86 58.04,41.91 57.78,41.66 57.78,39.37 57.9,39.26 | SW4.O1 59.91,38.86 58.29,38.86 57.9,39.26 | 57.9,39.26
D2
  Top 0.203: IOL.6 58.42,50.04 58.29,49.91 57.2,49.91 54.91,47.62 47.94,47.62 43.95,43.63 IC2.4
D3
  Top 0.203: IOL.5 55.55,50.8 52.88,48.13 47.84,48.13 43.55,43.84 IC2.5
D4
  Top 0.203: IOL.4 53.01,50.8 50.72,48.51 47.5,48.51 43.15,44.16 IC2.6
D5
  Top 0.203: IOL.3 48.9,48.9 47.24,48.9 42.74,44.4 IC2.7
D6
  Top 0.203: IC2.8 42.34,44.88 IOL.2
D7
  Top 0.203: IOL.1 41.95,47.02 IC2.9
D8
  Top 0.203: IC2.11 41.16,38.52 41.16,40.52 40.13,41.55 40.13,48.26 41.66,49.78 IOH.10
D9
  Top 0.203: IC2.12 40.74,40.32 39.61,41.45 39.61,48.02 39.12,48.51 IOH.9
D10
  Top 0.203: IC2.13 40.34,40.18 39.23,41.3 39.23,46.71 36.58,49.36 IOH.8
D11
  Top 0.203: IC2.14 39.95,40.04 38.84,41.14 38.84,46.23 34.27,50.8 IOH.7
D12
  Top 0.203: IC2.15 38.46,38.29 38.46,45.85 35.66,48.64 33.66,48.64 IOH.6
D13  (via drill 0.39, 0.48)
  Top 0.203: IC2.16 39.08,37.27 38.54,37.27 38,37.82 38,45.72 35.84,47.88 30.35,47.88 | 30.35,47.88 v30.35,47.31 | 30.35,47.88 28.96,49.28 IOH.5 | R11.1 15.62,32 20.07,36.45 v20.45,36.45
  Bottom 0.203: v30.35,47.31 30.35,46.61 20.45,36.7 v20.45,36.45
D24  (via drill 0.48)
  Top 0.203: IC2.36 42.76,31.58 42.76,29.09 56.09,15.76 56.09,11.49 55.33,10.73 55.33,8.57 v55.08,8.31
  Bottom 0.203: v55.08,8.31 56.09,8.31 60.96,3.45 AD.5
D25  (via drill 0.48)
  Top 0.203: IC2.37 43.16,31.58 43.16,29.23 56.56,15.83 56.56,10.46 v56.18,10.08
  Bottom 0.203: v56.18,10.08 56.31,10.08 63.5,2.88 AD.6
D+  (via drill 0.48)
  Top 0.203: IC2.47 47.8,34.05 47.96,33.89 48.29,33.89 v48.58,33.6 | v13.34,37.85 12.99,37.51 12.97,37.51 12.8,37.34 R25.2
  Bottom 0.203: v48.58,33.6 48.26,33.92 17.2,33.92 13.34,37.78 v13.34,37.85
D-  (via drill 0.48)
  Top 0.203: IC2.46 47.41,33.65 48.65,32.41 v48.76,32.51 | v13.21,38.92 11.78,38.92 R24.2
  Bottom 0.203: v48.76,32.51 49.43,33.19 49.43,33.78 48.88,34.33 18.18,34.33 13.59,38.92 v13.21,38.92
GND  (via drill 0.48)
  Top 0.203: IC2.19 41.55,36.05 IC2.P$1 | C3.1 39.75,21.52 39.75,23.37 v40.39,24
  other vias: 49.53,40.26 42.55,35.94 7.87,34.92 24,16 24.64,29.34 20.57,42.8 30.61,40.89 30.73,36.32 54.36,45.72 46.1,43.05 26.54,10.54 35.43,13.08 43.56,10.67 50.04,9.78 50.93,18.8 46.61,17.91 41.91,16.38 44.83,24.38 28.96,31.5 13.72,30.48 12.57,26.8 11.68,19.56 13.72,21.59 7.37,17.27 2.54,19.18 1.65,25.65 1.91,40.39 1.78,35.31 8.13,51.94 11.68,47.75 2.79,47.5 65.15,48.77 65.15,19.43 6.73,25.15 37.85,25.78 41.91,20.45 41.91,18.54 41.02,45.47 52.07,41.15 50.16,32.51
  pour Top: 0,53.34 68.58,53.34 68.58,0 0,0
  pour Bottom: 0,53.34 68.58,53.34 68.83,-0.32 0,0
MISO/SDIO_DAT0  (via drill 0.48)
  Top 0.203: v39.27,28.61 40.1,28.61 40.74,29.26 IC2.31 | X1.7 6.84,26.3 8.64,24.51 22.7,24.51 27.91,29.72 37.41,29.72 v37.82,30.12
  Bottom 0.203: v39.27,28.61 39.27,28.8 37.95,30.12 v37.82,30.12 | v37.82,30.12 37.82,30.58 38.44,31.2 40.36,31.2 43.24,28.32 61.21,28.32 ICSP.1 | v37.82,30.12
MOSI/SDIO_CMD  (via drill 0.39, 0.48)
  Top 0.203: v30.54,27.05 30.54,28.07 31.37,28.89 38.42,28.89 39.53,30 | IC2.30 40.34,30.82 39.53,30 | v39.97,29.5 39.53,29.94 39.53,30 | X1.3 10.99,21.9 14.48,18.41 v15.88,18.41
  Bottom 0.203: v30.54,27.05 30.54,20.19 28.77,18.41 v15.88,18.41 | ICSP.4 64.58,26.61 42.61,26.61 39.97,29.25 v39.97,29.5
N$1
  Top 0.203: R11.2 6.67,32.11 L.A
N$2
  Top 0.203: ON.A 6.62,30.5 R2.2
N$9
  Top 0.203: IC2.20 38.37,35.65 36.26,37.77 36.26,37.86 35.98,38.13 34.75,38.13 34.59,37.97 34.59,37.19 34.35,36.95 33.22,36.95 32.56,37.6 Y1.3 32.13,36.04 32.3,35.88 C26.2
N$10
  Top 0.203: C27.2 33.87,38.94 | 33.87,38.94 Y1.1 | R23.1 35.3,38.94 33.87,38.94
N$11
  Top 0.813: R16.2 R1.1 29.66,17.11 TR1.1
N$12
  Top 0.203: R23.2 36.07,37.31 38.13,35.25 IC2.21
N$15
  Top 0.61: D1.C 20.27,7.85 19.07,9.05 T2.2 17.5,9.97 R7.2
NEOPIX  (via drill 0.39)
  Top 0.203: IC2.17 38.42,36.85 37.57,37.7 37.57,40.13 v37.06,40.64 | v57.53,33.91 58.67,32.77 58.67,24.26 60.45,22.48 65.91,22.48 66.64,21.76 LED2.1
  Bottom 0.203: v37.06,40.64 40.37,37.34 51.82,37.34 55.24,33.91 v57.53,33.91
PWR_SWITCH
  Top 0.203: R7.1 18.85,12.03 18.86,12.08 T2.1 20.07,10.87 20.07,9.53 20.85,8.74 JP1.1 22.7,8.27 SW1.B
PWRIN  (via drill 0.48)
  Top 0.813: v18.16,7.56 18.07,7.47 D1.A
  Bottom 0.813: v18.16,7.56 10.82,7.56 X5.PWR
QSPI_CS  (via drill 0.39)
  Top 0.203: IC2.56 46.21,37.65 47.17,38.62 47.17,43.36 v47.27,43.46 47.27,44.35 48.26,45.34 52.2,45.34 53.09,44.45 U6.1 54.32,42.34 R17.1 | R26.1 v59.18,35.31
  Bottom 0.203: v59.18,35.31 56.64,35.31 53.34,38.61 49.28,38.61 47.27,40.62 v47.27,43.46
QSPI_DATA[0]
  Top 0.203: U6.5 48.95,36.62 47.09,36.62 46.92,36.45 IC2.53
QSPI_DATA[1]
  Top 0.203: IC2.55 46.53,37.25 48.01,38.73 48.01,44.45 48.51,44.96 51.69,44.96 51.82,44.83 U6.2
QSPI_DATA[2]
  Top 0.203: IC2.54 46.72,36.85 48.48,38.61 49.53,38.61 50.55,39.62 U6.3
QSPI_DATA[3]
  Top 0.203: IC2.51 47.2,35.65 47.41,35.86 47.97,35.86 48.7,35.13 51.26,35.13 51.82,35.69 U6.7
QSPI_SCK
  Top 0.203: IC2.52 47.06,36.05 47.25,36.24 48.13,36.24 48.85,35.51 50.37,35.51 50.55,35.69 U6.6
RXD
  Top 0.203: IOL.8 63.5,50.55 59.69,46.74 59.69,43.69 58.67,42.67 SW4.P1
SCK/SDIO_CLK  (via drill 0.48)
  Top 0.203: IC2.29 39.95,30.99 39.05,30.1 | 39.05,30.1 38.29,29.34 28.07,29.34 22.83,24.1 X1.5 | 39.05,30.1 38.87,30.29 v38.87,30.48
  Bottom 0.203: v38.87,30.48 40.33,30.48 42.86,27.94 ICSP.3
SCL  (via drill 0.39)
  Top 0.203: IC2.28 36.74,30.1 31.62,30.1 18.76,42.97 18.8,42.97 18.76,43 R10.2 18.8,45 IOH.1 | CONN1.4 6.75,49.89 v6.73,49.91
  Bottom 0.203: v6.73,49.91 7.49,50.67 11.43,50.67 13.46,48.64 17.65,48.64 18.8,49.78 IOH.1
SD_CD  (via drill 0.39, 0.48)
  Top 0.203: IC2.18 38.22,36.45 36.62,38.05 v36.62,38.81 | v22.48,35.56 22.48,29.46 19.72,26.7 v17.65,26.7 X1.CD1 | X1.CD2 17.27,21.08 v17.4,20.95
  Bottom 0.203: v36.62,38.81 33.37,35.56 v22.48,35.56 | v17.4,20.95 17.4,26.45 v17.65,26.7
SDA  (via drill 0.39)
  Top 0.203: IC2.27 38.56,32.85 38.38,32.67 38.38,32.41 36.45,30.48 31.79,30.48 21.38,40.89 R13.2 21.34,45 IOH.2 | CONN1.3 v7.75,49.9 v7.75,49.91
  Bottom 0.203: v7.75,49.91 8.13,50.29 11.27,50.29 13.3,48.26 19.94,48.26 21.34,49.66 IOH.2
SDCS/SDIO_DAT3  (via drill 0.39)
  Top 0.203: IC2.35 42.34,22.86 v41.66,22.86 | v8.89,20.7 8.79,20.8 5.84,20.8
  Top 0.254: R3.1 5.55,15.91 4.45,17.02 4.45,20.32 4.93,20.8 5.84,20.8 X1.2
  Bottom 0.203: v41.66,22.86 38.1,22.86 29.72,14.48 15.11,14.48 v8.89,20.7
SDIO_DAT1  (via drill 0.39)
  Top 0.203: X1.8 6.63,27.4 9.14,24.89 22.48,24.89 28.11,30.52 v30.23,30.52 | v32.64,27.81 40.39,27.81 41.15,28.57 IC2.32
  Bottom 0.203: v32.64,27.81 32.64,28.24 30.35,30.52 v30.23,30.52
SDIO_DAT2  (via drill 0.39)
  Top 0.203: X1.1 8.87,19.7 v9.02,19.56 | v40.77,22.18 40.98,22.39 40.98,23.14 41.38,23.54 41.94,23.54 41.95,23.53 IC2.34
  Bottom 0.203: v9.02,19.56 14.48,14.1 29.97,14.1 38.1,22.23 40.77,22.23 v40.77,22.18
SWCLK  (via drill 0.39, 0.48)
  Top 0.203: IC2.24 37.29,34.05 35.24,32 v35.24,31.37 | SWD.4 54.41,15.75 54.8,15.36 v54.8,15.18 | v59.69,15.11 61.58,13.22 DEBUG.1
  Bottom 0.203: v35.24,31.37 35.81,30.8 35.81,30.35 48.93,17.24 51.34,17.24 53.41,15.18 v54.8,15.18 59.63,15.18 v59.69,15.11
SWDIO  (via drill 0.39, 0.48)
  Top 0.203: IC2.25 37.43,33.65 36.41,32.63 v36.41,31.56 | v49.91,18.03 51.24,18.03 52.26,17.02 SWD.2 | v61.72,15.37 63.13,15.37 DEBUG.3
  Bottom 0.203: v36.41,31.56 36.39,31.53 36.39,30.42 48.9,17.91 49.78,17.91 v49.91,18.03 51.82,18.03 53.59,16.26 60.83,16.26 v61.72,15.37
TXD
  Top 0.203: IOL.7 60.96,49.66 58.67,47.37 SW4.P2
USB_D+  (via drill 0.48)
  Top 0.203: X3.A6 7.37,38.35 7.37,37.59 | 7.37,37.59 7.37,37.34 R25.1 | 7.37,37.59 7.12,37.35 X3.B6 6.36,37.39 5.51,37.39 v5.08,36.96
  Bottom 0.203: v5.08,36.96 3.11,36.96 D+1.TP
USB_D-  (via drill 0.48)
  Top 0.203: R24.1 10,38.85 X3.B7 | X3.A7 5.46,37.85 5.27,38.03 5.27,38.73 5.39,38.85 X3.B7 | X3.B7 5.23,38.85 5.18,38.8 v5.01,38.8
  Bottom 0.203: v5.01,38.8 3.36,38.8 D-1.TP
USBBOOT  (via drill 0.39)
  Top 0.203: SW3.1 v63.36,39.62 63.36,36.48 R26.2
  Bottom 0.178: TP1.P$1 62.35,40.64 v63.36,39.62
VBUS  (via drill 0.48)
  Top 0.61: F2.2 14.14,42.92 C5.2 16.92,42.92 | v26.99,31.81 26.99,33.53 17.69,42.82 C7.1 | TR1.3 27.42,19.74 v27.94,20.26
  Top 0.813: 16.92,42.92 C7.1
  Bottom 0.61: v27.94,20.26 27.94,30.86 v26.99,31.81
VBUS_UNFUSE
  Top 0.254: X3.B4A9 6.33,35.77 5.77,35.77 5.62,35.92 4.6,35.92 4.13,36.39 4.13,39.56 4.85,40.28 5.62,40.28 5.89,40.56 6.34,40.56 X3.A4B9
  Top 0.61: X3.A4B9 7.86,40.5 9.81,42.45 10.51,42.45 F2.1
VIN  (via drill 0.48)
  Top 0.61: R1.2 29.29,13.7 PC1.+ 28.09,13.46 | U1.3 32.02,8.75 28.09,12.68 28.09,13.46 | 28.09,13.46 26.94,13.46 24.16,10.68 C12.1 21.07,10.68 T2.3
  Top 0.813: v36.77,8.7 32.66,8.7 U1.3 | POWER.8 v45.72,6.29
  Bottom 0.813: v45.72,6.29 39.18,6.29 v36.77,8.7

### Text on the board
tNames: SCL | SDA | AREF | GND | 1 | ANALOG IN | IOREF | RESET | 3V3 | 5V | GND | VIN | A0 | A1 | A2 | A3 | A4 | A5
214bmp: D:/SmartProjects/Snc/a4_bn_logo2.bmp